# EAGLE design charge controller (EAGLE 9.4.0)
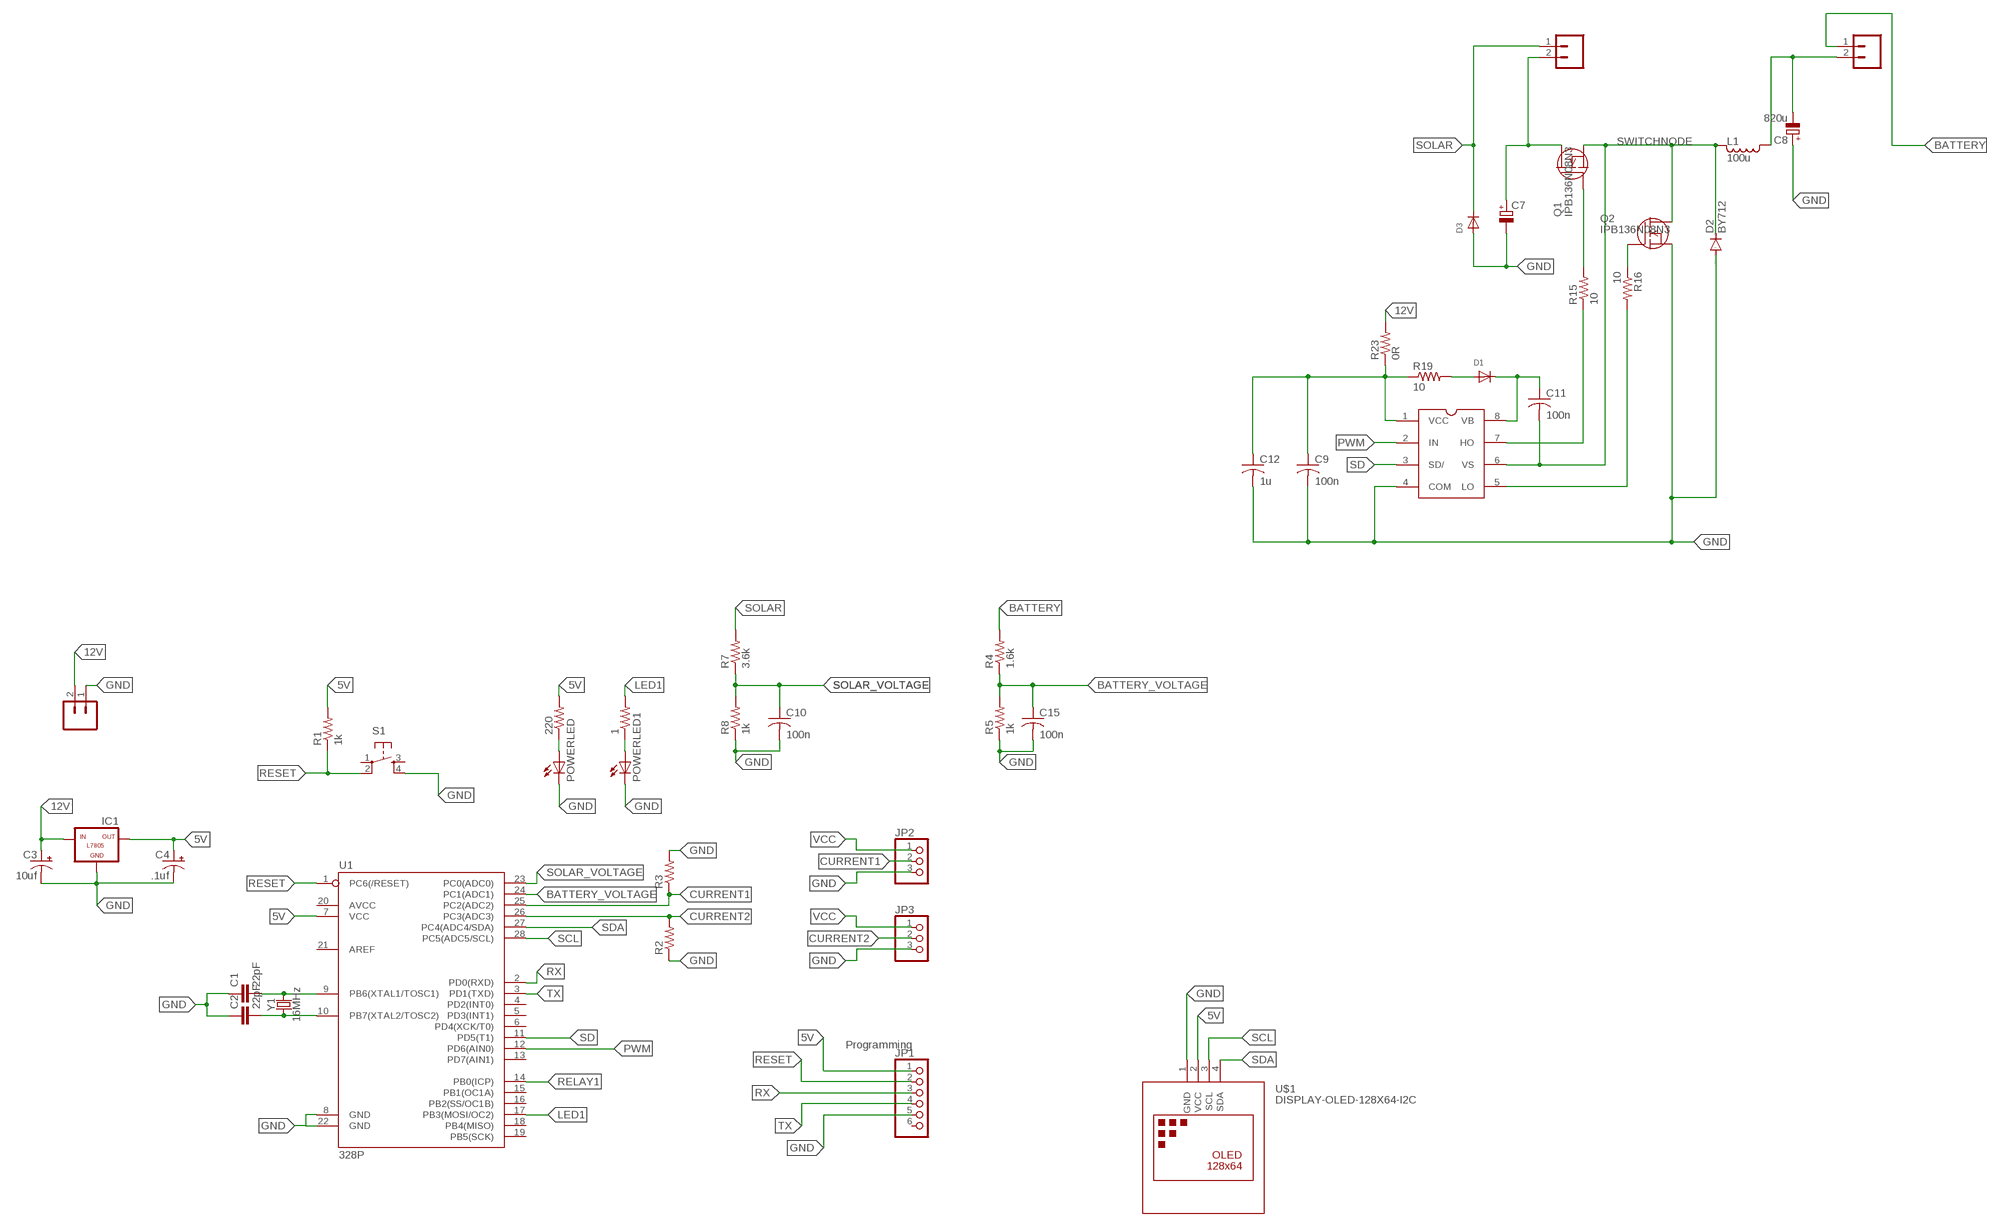
[diagram p0: schematic, sheet 1]

## Parts
1  R-US_0204/5  [0204/5]
220  R-US_0204/5  [0204/5]
BATTERY-OUT  CONN_023.5MM_LOCK  [SCREWTERMINAL-3.5MM-2_LOCK]
C1  22pF  22PF-PTH-2.54MM-200V-5%  [CAP-PTH-2.54]
C2  22pF  22PF-PTH-2.54MM-200V-5%  [CAP-PTH-2.54]
C3  10uf  CPOL-USE5-5  [E5-5]
C4  .1uf  CPOL-USE5-5  [E5-5]
C7  680u  C_POLARIZED10MM  [10MM]
C8  820u  C_POLARIZED10MM  [10MM]
C9  100n  C-US050-025X075  [C050-025X075]
C10  100n  C-US050-025X075  [C050-025X075]
C11  100n  C-US050-055X075  [C050-055X075]
C12  1u  C-US050-025X075  [C050-025X075]
C15  100n  C-US050-025X075  [C050-025X075]
D1  DIODEDO-1N4148  [DO-1N4148]
D2  BY712  [SOD61E]
D3  DIODEDO-1N4148  [DO-1N4148]
IC1  L7805  [78XXL]
J1  CONN_023.5MM_LOCK  [SCREWTERMINAL-3.5MM-2_LOCK]
JP1  PINHD-1X6  [1X06]
JP2  PINHD-1X3  [1X03]
JP3  PINHD-1X3  [1X03]
L1  100u  INDUCTORMSS1583  [MSS1583]
POWERLED  LED5MM  [LED5MM]
POWERLED1  LED5MM  [LED5MM]
Q1  IPB136N08N3  IRF840  [TO220]
Q2  IPB136N08N3  IRF840  [TO220]
R1  1k  R-US_0204/5  [0204/5]
R2  R-US_0204/5  [0204/5]
R3  R-US_0204/5  [0204/5]
R4  1.6k  R-US_0204/5  [0204/5]
R5  1k  R-US_0204/5  [0204/5]
R7  3.6k  R-US_0204/5  [0204/5]
R8  1k  R-US_0204/5  [0204/5]
R15  10  R-US_0204/7  [0204/7]
R16  10  R-US_0204/7  [0204/7]
R19  10  R-US_0204/7  [0204/7]
R23  0R  R-US_0204/7  [0204/7]
S1  TAC_SWITCHPTH  [TACTILE-PTH]
SOLAR-IN  CONN_023.5MM_LOCK  [SCREWTERMINAL-3.5MM-2_LOCK]
U1  328P  ATMEGA328P_PDIP  [DIP28]
U$1  DISPLAY-OLED-128X64-I2C  [DISPLAY-OLED-128X64-I2C]
U$2  IR2104  [IR2104]
Y1  16MHz  CRYSTAL-16MHZPTH-HC49US  [HC49US]

## Nets
5V: 220.2 C4.+ IC1.OUT JP1.1 R1.2 U1.7(VCC) U$1.2(VCC)
12V: C3.+ IC1.IN J1.2 R23.2
BATTERY: BATTERY-OUT.1 R4.2
BATTERY_VOLTAGE: C15.1 R4.1 R5.2 U1.24(PC1(ADC1))
CURRENT1: JP2.2 R3.1 U1.25(PC2(ADC2))
CURRENT2: JP3.2 R2.2 U1.26(PC3(ADC3))
GND: C1.1 C2.1 C3.- C4.- C7.- C8.+ C9.2 C10.2 C12.2 C15.2 D2.A D3.A IC1.GND J1.1 JP1.5 JP2.3 JP3.3 POWERLED1.K(C) POWERLED.K(C) Q2.3(S) R2.1 R3.2 R5.1 R8.1 S1.4 U1.8(GND) U1.22(GND) U$1.1(GND) U$2.4(COM)
LED1: 1.2 U1.17(PB3(MOSI/OC2))
N$1: 220.1 POWERLED.A
N$2: C1.2 U1.9(PB6(XTAL1/TOSC1)) Y1.2
N$3: C2.2 U1.10(PB7(XTAL2/TOSC2)) Y1.1
N$4: D1.A R19.2
N$5: 1.1 POWERLED1.A
N$7: BATTERY-OUT.2 C8.- L1.1
N$8: Q1.1(G) R15.2
N$9: C7.+ Q1.2(D) SOLAR-IN.2
N$11: Q2.1(G) R16.1
N$12: C11.1 D1.C U$2.8(VB)
N$14: R15.1 U$2.7(HO)
N$15: R16.2 U$2.5(LO)
N$19: C9.1 C12.1 R19.1 R23.1 U$2.1(VCC)
PWM: U1.12(PD6(AIN0)) U$2.2(IN)
RELAY1: U1.14(PB0(ICP))
RESET: JP1.2 R1.1 S1.2 U1.1(PC6(/RESET))
RX: JP1.3 U1.2(PD0(RXD))
SCL: U1.28(PC5(ADC5/SCL)) U$1.3(SCL)
SD: U1.11(PD5(T1)) U$2.3(SD/)
SDA: U1.27(PC4(ADC4/SDA)) U$1.4(SDA)
SOLAR: D3.C R7.2 SOLAR-IN.1
SOLAR_VOLTAGE: C10.1 R7.1 R8.2 U1.23(PC0(ADC0))
SWITCHNODE: C11.2 D2.C L1.2 Q1.3(S) Q2.2(D) U$2.6(VS)
TX: JP1.4 U1.3(PD1(TXD))
VCC: JP2.1 JP3.1
Unconnected: JP1.6 S1.1 S1.3 U1.4(PD2(INT0)) U1.5(PD3(INT1)) U1.6(PD4(XCK/T0)) U1.13(PD7(AIN1)) U1.15(PB1(OC1A)) U1.16(PB2(SS/OC1B)) U1.18(PB4(MISO)) U1.19(PB5(SCK)) U1.20(AVCC) U1.21(AREF)

## Notes on the sheet
- Programming

## Library data of the parts
1 220 R1-R5 R7 R8 R15 R16 R19 R23 = adafruit:R-US_: RESISTOR, American symbol
BATTERY-OUT J1 SOLAR-IN = SparkFun-Connectors:CONN_02: Multi connection point. Often used as Generic Header-pin footprint for 0.1 inch spaced/style header connections On any of the 0.1 inch spaced packages, you can populate with these: Break Away Headers - Straight <https://www.sparkfun.com/products/116> (PRT-00116) Break Away Male Headers - Right Angle <https://www.sparkfun.com/products/553> (PRT-00553) Female Headers <https://www.sparkfun.com/products/115> (PRT-00115) Break Away Headers - Machine Pin <https://www.sparkfun.com/products/117> (PRT-00117) Break Away Female Headers - Swiss Machine Pin <https://www.sparkfun.com/products/743> (PRT-00743) For SCREWTERMINALS and SPRING TERMINALS visit here: Screw Terimnals on SparkFun.com <https://www.sparkfun.com/search/results?term=Screw+Terminals> (5mm/3.5mm/2.54mm spacing) This device is also useful as a general connection point to wire up your design to another part of your project. Our various solder wires solder well into these plated through hole pads. Hook-Up Wire - Assortment (Stranded, 22 AWG) <https://www.sparkfun.com/products/11375> (PRT-11375) Hook-Up Wire - Assortment (Solid Core, 22 AWG) <https://www.sparkfun.com/products/11367> (PRT-11367) View the entire wire category on our website here <https://www.sparkfun.com/categories/141> Special notes: Molex polarized connector foot print use with: PRT-08233 with associated crimp pins and housings. 2.54_SCREWTERM for use with PRT-10571. 3.5mm Screw Terminal footprints for PRT-08084 5mm Screw Terminal footprints for use with PRT-08432; PROD_ID: CONN-08399
C1 C2 = SparkFun-Capacitors:22PF: 22pF ceramic capacitors A capacitor is a passive two-terminal electrical component used to store electrical energy temporarily in an electric field.; PROD_ID: CAP-09128
C3 C4 = adafruit:CPOL-US: POLARIZED CAPACITOR, American symbol
C7 C8 = 00Capacitor:C_POLARIZED
C9-C12 C15 = adafruit:C-US: CAPACITOR, American symbol
D1 D3 = adafruit:DIODE: Diode SMADIODE - SMA Surface Mount Package 20V 1A Schottky Diode Digikey: 641-1014-6-ND DO-1N4148 - Through Hole Small Current Diode SOD-123 20V 1 A (.5mV Vf) Schottky Diode - Digikey: MBRX120TPMSCT-ND SOD-323 10V 570mA (.38mV Vf, 3ns) Schottky Diode - Digikey: ZLLS410CT-ND SOD-523 30V 30mA Schottky Diode (RB751S-40TE61) - Digikey: RB751S-40TE61CT-ND SOT23-R/W - SOT23 Package (R = Solder Paste/Reflow Ovens, W = Hand-Soldering) BAT54Film 40V 300mA - Digikey: 497-7162-1-ND
D2 = diode:BY712: DIODE fast high-voltage soft-recovery rectifier
IC1 = tango:L7805: VOLTAGE REGULATOR
JP1 = adafruit:PINHD-1X6: PIN HEADER
JP2 JP3 = adafruit:PINHD-1X3: PIN HEADER
L1 = 00Inductor:INDUCTOR
POWERLED POWERLED1 = adafruit:LED: LED OSRAM: - CHIPLED LG R971, LG N971, LY N971, LG Q971, LY Q971, LO R971, LY R971 LH N974, LH R974 LS Q976, LO Q976, LY Q976 LO Q996 - Hyper CHIPLED LW Q18S LB Q993, LB Q99A, LB R99A - SideLED LS A670, LO A670, LY A670, LG A670, LP A670 LB A673, LV A673, LT A673, LW A673 LH A674 LY A675 LS A676, LA A676, LO A676, LY A676, LW A676 LS A679, LY A679, LG A679 - Hyper Micro SIDELED® LS Y876, LA Y876, LO Y876, LY Y876 LT Y87S - SmartLED LW L88C, LW L88S LB L89C, LB L89S, LG L890 LS L89K, LO L89K, LY L89K LS L896, LA L896, LO L896, LY L896 - TOPLED LS T670, LO T670, LY T670, LG T670, LP T670 LSG T670, LSP T670, LSY T670, LOP T670, LYG T670 LG T671, LOG T671, LSG T671 LB T673, LV T673, LT T673, LW T673 LH T674 LS T676, LA T676, LO T676, LY T676, LB T676, LH T676, LSB T676, LW T676 LB T67C, LV T67C, LT T67C, LS T67K, LO T67K, LY T67K, LW E67C LS E67B, LA E67B, LO E67B, LY E67B, LB E67C, LV E67C, LT E67C LW T67C LS T679, LY T679, LG T679 LS T770, LO T770, LY T770, LG T770, LP T770 LB T773, LV T773, LT T773, LW T773 LH T774 LS E675, LA E675, LY E675, LS T675 LS T776, LA T776, LO T776, LY T776, LB T776 LHGB T686 LT T68C, LB T68C - Hyper Mini TOPLED® LB M676 - Mini TOPLED Santana® LG M470 LS M47K, LO M47K, LY M47K Source: http://www.osram.convergy.de/
Q1 Q2 = tango:IRF840: N-Channel Enhancement MOSFET (HEXFET); 500V; 8A; 0,85Ohm
S1 = SparkFun-Retired:TAC_SWITCH: Momentary Switch Button commonly used for reset or general input. Spark Fun Electronics SKU : COM-00097 SMT- SWCH-08247
U1 = SparkFun-IC-Microcontroller:ATMEGA328P_PDIP: Atmel 328P Through hole ATMEGA328P uC used in the Arduino 32kb flash, 1k EEPROM, 2k SRAM Datasheet <http://www.sparkfun.com/datasheets/Components/SMD/ATMega328.pdf> SparkFun Products Storefront component: AVR 28 Pin 20MHz 32K 6A/D - ATMega328P <https://www.sparkfun.com/products/9061> (COM-09061) SparkFun Simon Says - Through-Hole Soldering Kit <https://www.sparkfun.com/products/10547> (KIT-10547) SparkFun Learn to Solder - Simon Says <https://www.sparkfun.com/products/13708> (KIT-13708) SparkFun BigTime Watch Kit <https://www.sparkfun.com/products/11734> (KIT-11734) SparkFun ClockIt <https://www.sparkfun.com/products/10930> (KIT-10930) SparkFun Serial Enabled LCD Kit <https://www.sparkfun.com/products/10097> (LCD-10097) SparkFun Simon Tilts - Through Hole Soldering Kit <https://www.sparkfun.com/products/12634> (KIT-12634) SparkFun Frequency Counter Kit <https://www.sparkfun.com/products/10140> (KIT-10140) FabFM Radio Kit <https://www.sparkfun.com/products/11043> (KIT-11043) SparkFun Binary Blaster Kit <https://www.sparkfun.com/products/12037> (KIT-12037) SparkFun Metro-Gnome <https://www.sparkfun.com/products/9236> (KIT-09236) ATmega328 with Arduino Optiboot (Uno) <https://www.sparkfun.com/products/10524> (DEV-10524); PROD_ID: IC-09136
U$1 = diy-modules:DISPLAY-OLED-128X64-I2C: 128x64 Dot Matrix OLED Module based on SSD1306 chip Variant with I2C interface More details available here: http://www.instructables.com/id/Monochrome-096-i2c-OLED-display-with-arduino-SSD13/ SSD1306 datasheet: https://cdn-shop.adafruit.com/datasheets/SSD1306.pdf Click here to find device on ebay.com <http://www.ebay.com/sch/oled+display+128x64+iic> Note: There are two variants: I2C and SPI. Search for the proper version.
U$2 = ir-2104:IR2104: Half Bridge mosfet - IGBT driver
Y1 = SparkFun-Clocks:CRYSTAL-16MHZ: 16MHz Crystal Digikey Example <http://www.digikey.com/product-search/en?keywords=535-9122-1-ND> Frequency: 16MHz Frequency Stability: ±50ppm Frequency Tolerance: ±20ppm Load Capacitance: 18pF SparkFun Products: Pro Micro -5V/16MHz <https://www.sparkfun.com/products/12640> SparkFun Serial Enabled LCD Kit <https://www.sparkfun.com/products/10097>; PROD_ID: XTAL-08181; SF_ID: COM-00536

## Board
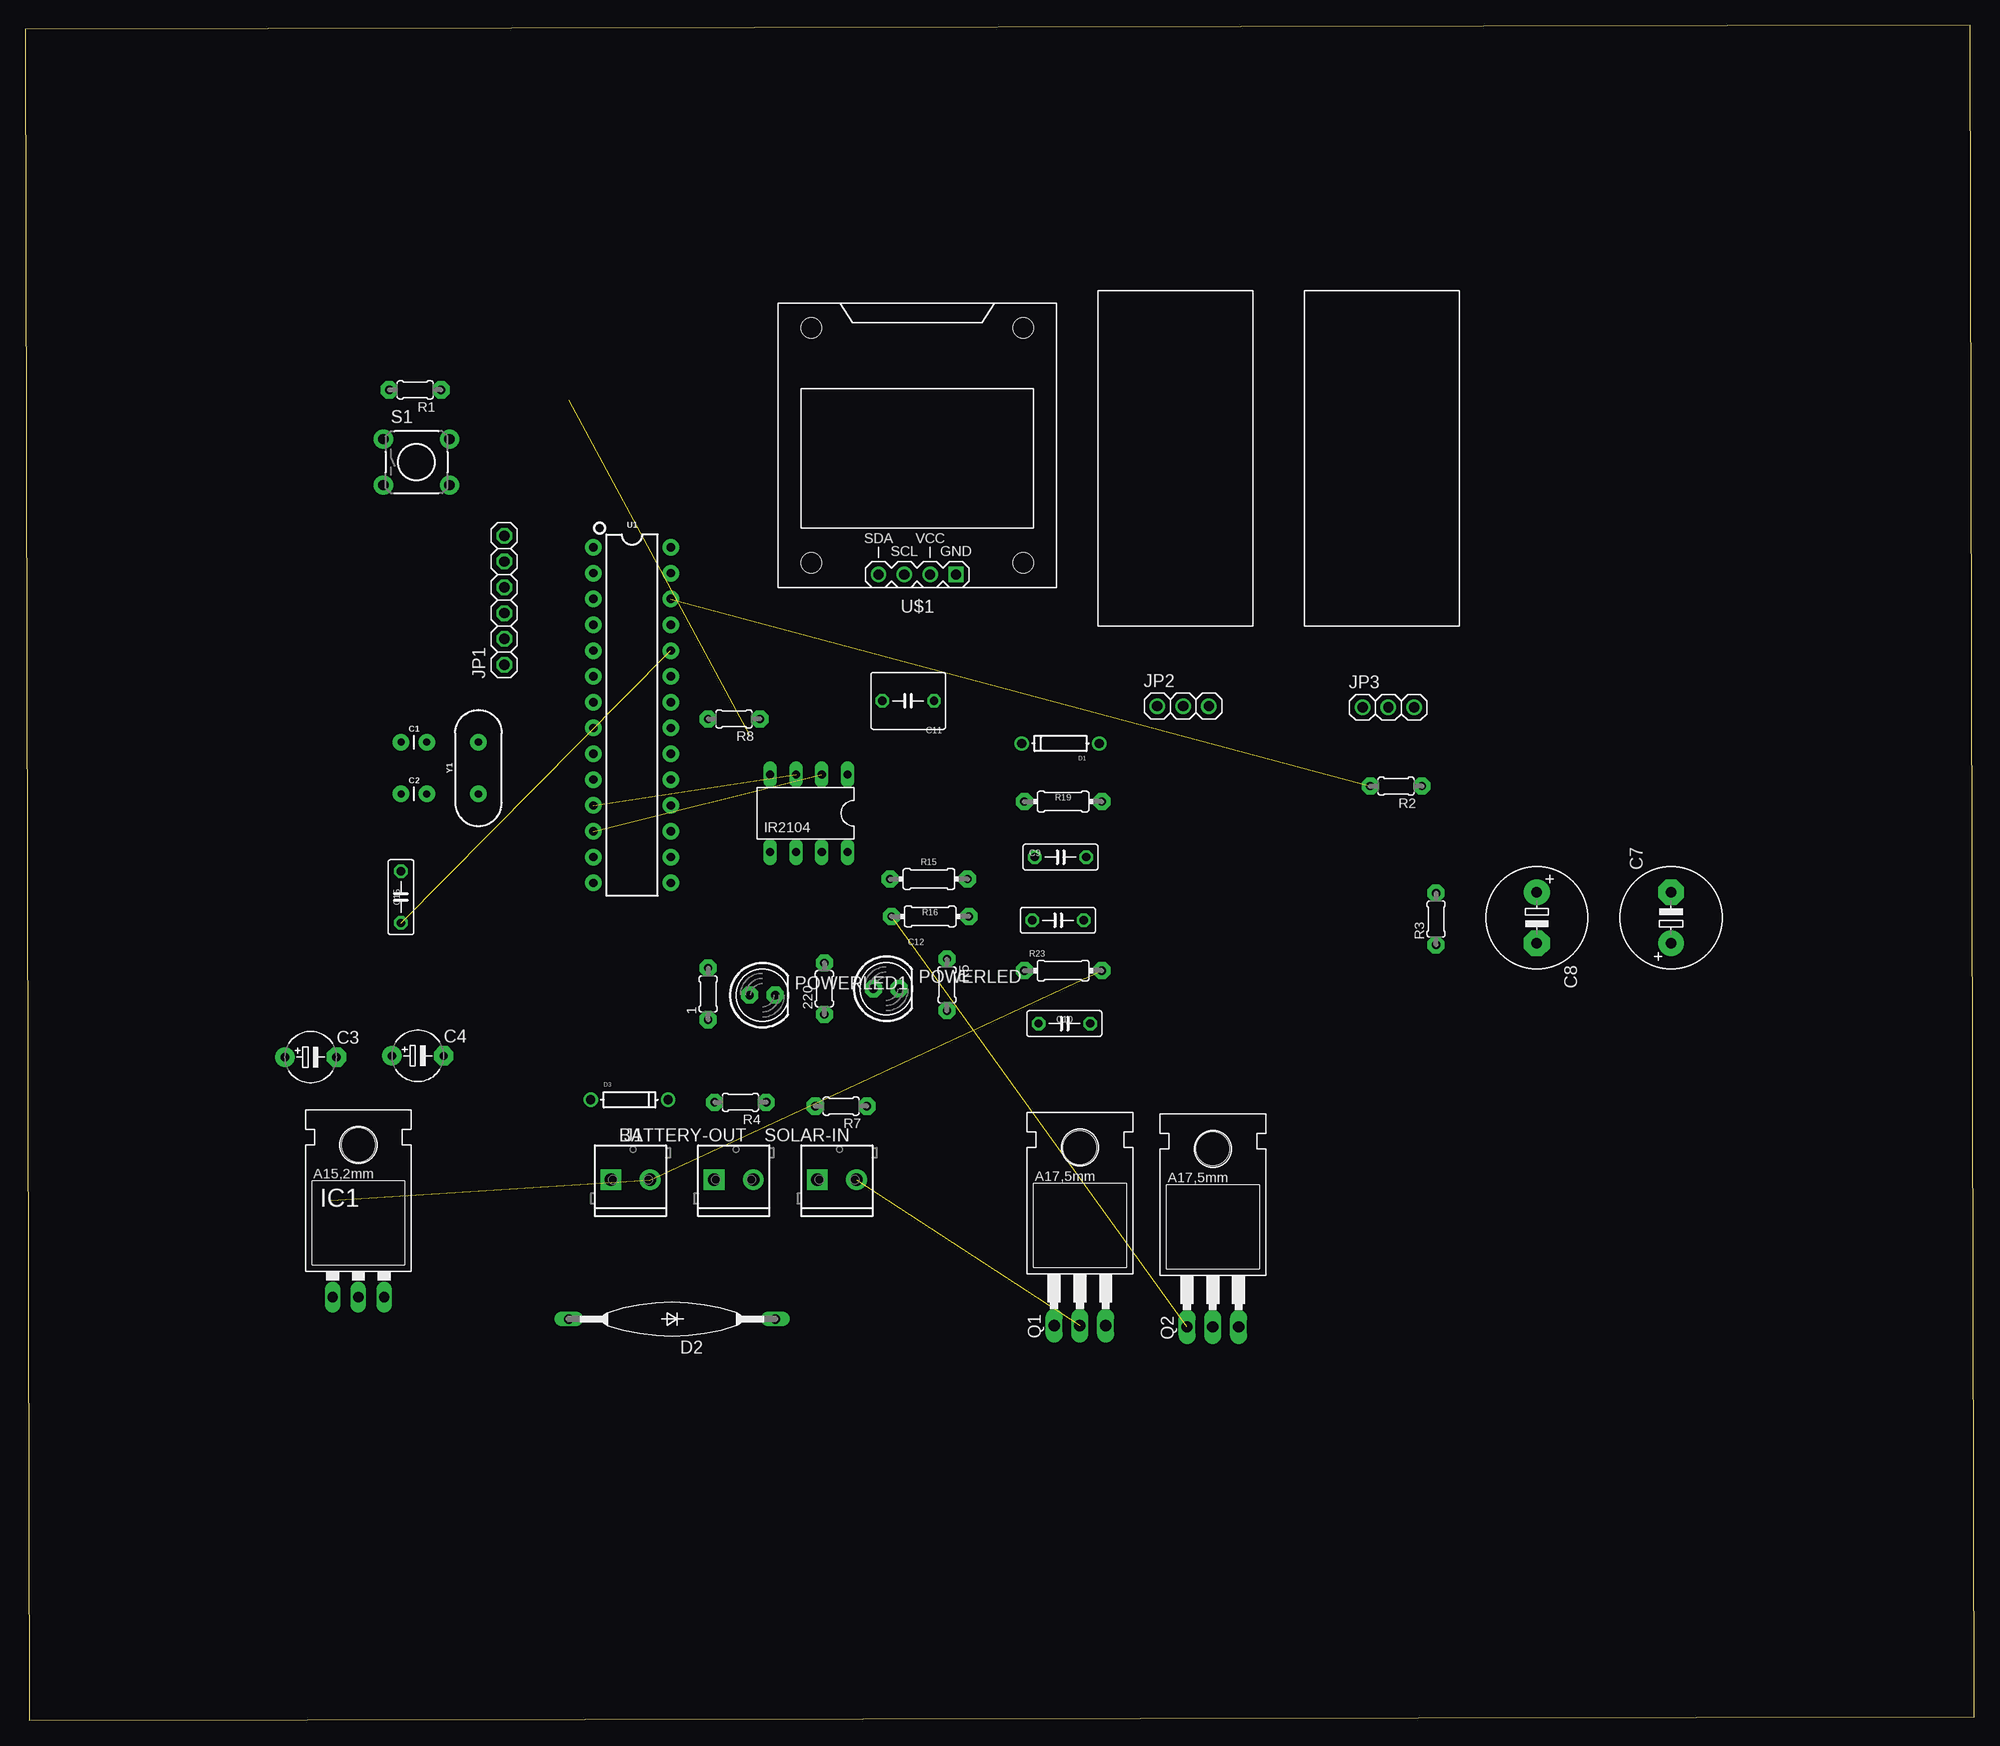
[diagram p1: board, top side]
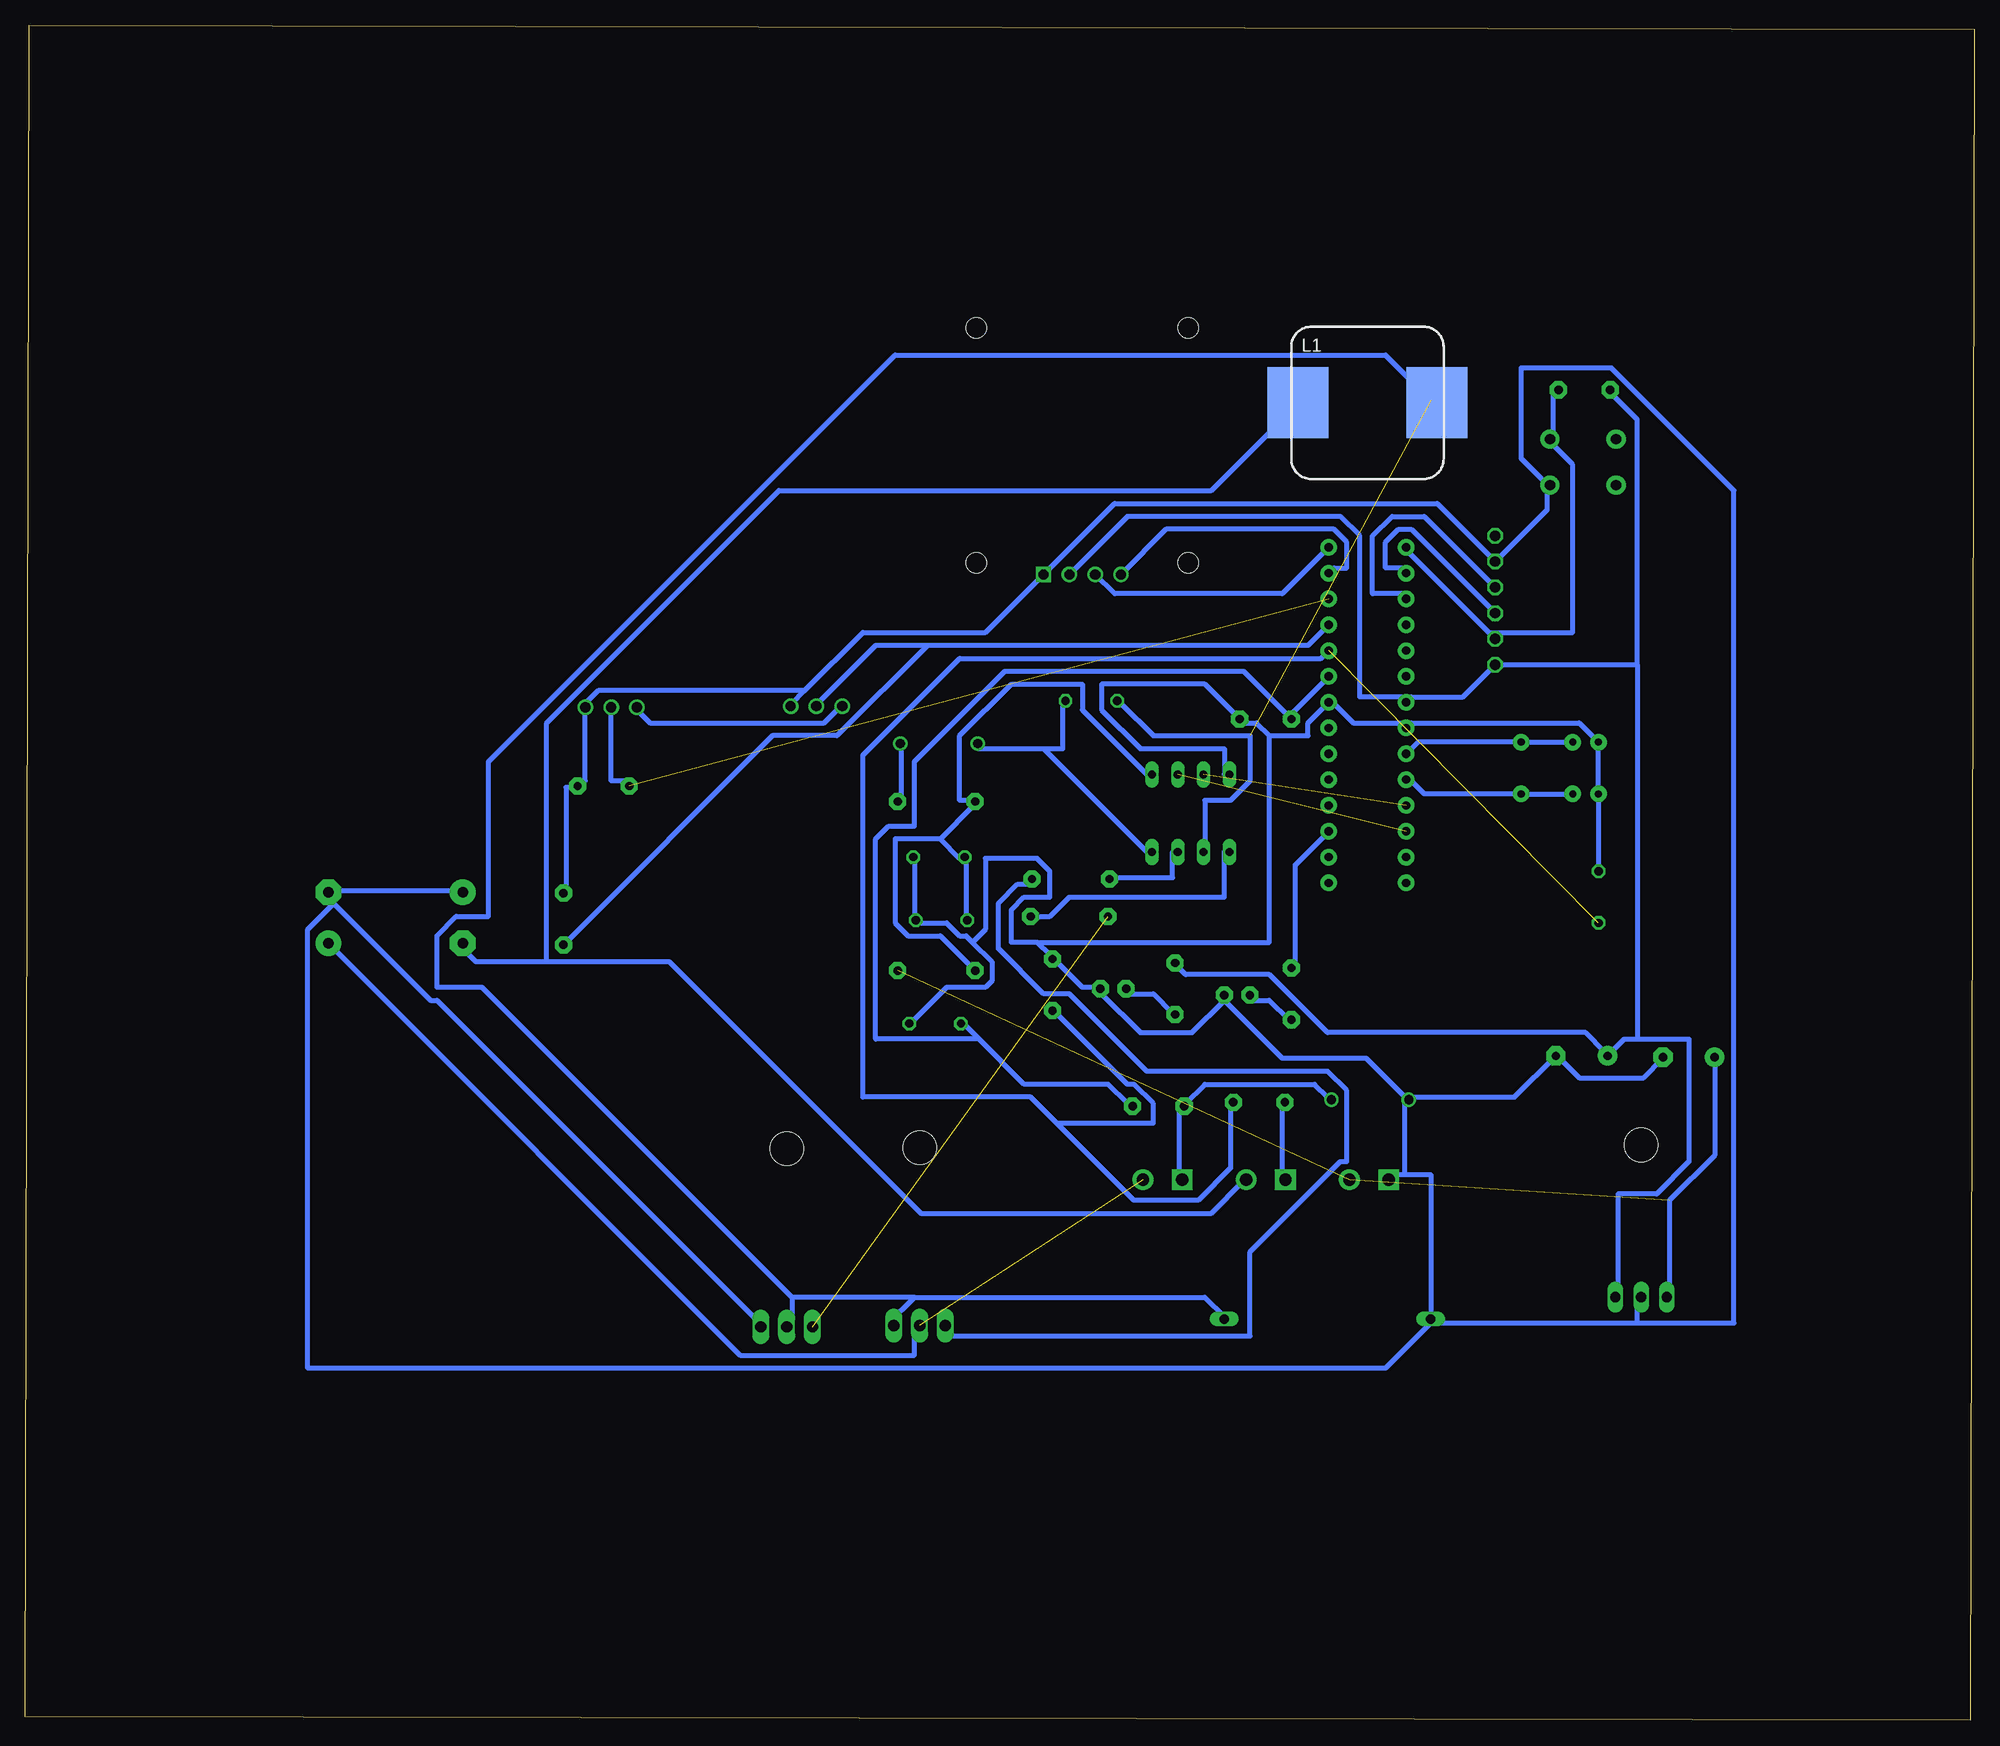
[diagram p2: board, bottom side, seen from below]

Size 191.75 x 166.8 mm. Coordinates in mm from the lower left corner, seen from the top.
Outline: 0.38,0 191.75,0.38 191.37,166.8 0,166.42 0.38,0
Copper layers (1*16): Top 0.035mm / dielectric 1.5mm / Bottom 0.035mm
Design rules "default *": minimum track width 20mil, minimum drill 0.35mm, track to track 20mil, track to pad 20mil, pad to pad 6mil, via to via 6mil, smd to smd 6mil, copper to edge 40mil, drill to drill 6mil, minimum pad ring 10mil, minimum via ring 8mil, stop-mask expansion 4mil, vias tented up to drill 0mil, thermal gap 10mil

### Footprints (pad centres in the part's own frame; a part is rotated, then mirrored left to right if it is on the bottom)
0204/5 = drill 0.813 pad 1.676 octagon: 1 -2.54,0; 2 2.54,0
SCREWTERMINAL-3.5MM-2_LOCK = drill 1.2 pad 2.032 square: 1 -0.178,0 | drill 1.2 pad 2.032: 2 3.678,0
CAP-PTH-2.54 = drill 0.7 pad 1.651: 1 -1.27,0; 2 1.27,0
E5-5 = drill 0.813 pad 1.905: + -2.54,0 | drill 0.813 pad 1.905 octagon: - 2.54,0
10MM = drill 1.016 pad 2.54: + -2.5,0 | drill 1.016 pad 2.54 octagon: - 2.5,0
C050-025X075 = drill 0.813 octagon: 1 -2.54,0; 2 2.54,0
C050-055X075 = drill 0.813 octagon: 1 -2.54,0; 2 2.54,0
DO-1N4148 = drill 0.9: A -3.81,0; C 3.81,0
SOD61E = drill 0.914 long: A 10.16,0; C -10.16,0
78XXL = drill 1.016 long: GND 0,-3.81; IN -2.54,-3.81; OUT 2.54,-3.81 | hole 3.302: 0,11.176
1X06 = drill 1.016 octagon: 1 -6.35,0; 2 -3.81,0; 3 -1.27,0; 4 1.27,0; 5 3.81,0; 6 6.35,0
1X03 = drill 1.016: 1 -2.54,0; 2 0,0; 3 2.54,0
MSS1583 = smd 6 x 7: 1 -6.85,0; 2 6.85,0
LED5MM = drill 0.813 pad 1.676 octagon: A -1.27,0; K 1.27,0
TO220 = drill 1.118 long: 1 -2.54,-6.35; 2 0,-6.35; 3 2.54,-6.35 | hole 3.302: 0,11.176
0204/7 = drill 0.813 pad 1.676 octagon: 1 -3.81,0; 2 3.81,0
TACTILE-PTH = drill 1.016 pad 1.88: 1 -3.251,2.261; 2 3.251,2.261; 3 -3.251,-2.261; 4 3.251,-2.261
DIP28 = drill 0.813 pad 1.626: 1 -16.51,-3.81; 2 -13.97,-3.81; 3 -11.43,-3.81; 4 -8.89,-3.81; 5 -6.35,-3.81; 6 -3.81,-3.81; 7 -1.27,-3.81; 8 1.27,-3.81; 9 3.81,-3.81; 10 6.35,-3.81; 11 8.89,-3.81; 12 11.43,-3.81; 13 13.97,-3.81; 14 16.51,-3.81; 15 16.51,3.81; 16 13.97,3.81; 17 11.43,3.81; 18 8.89,3.81; 19 6.35,3.81; 20 3.81,3.81; 21 1.27,3.81; 22 -1.27,3.81; 23 -3.81,3.81; 24 -6.35,3.81; 25 -8.89,3.81; 26 -11.43,3.81; 27 -13.97,3.81; 28 -16.51,3.81
DISPLAY-OLED-128X64-I2C = drill 1 square: 1 -3.81,12.7 | drill 1: 2 -1.27,12.7; 3 1.27,12.7; 4 3.81,12.7 | hole 2: -10.414,11.557; 10.414,11.557; 10.414,-11.557; -10.414,-11.557
IR2104 = drill 0.8 long: 1 -1.905,8.89; 2 -1.905,6.35; 3 -1.905,3.81; 4 -1.905,1.27; 5 5.715,1.27; 6 5.715,3.81; 7 5.715,6.35; 8 5.715,8.89
HC49US = drill 0.7 pad 1.651: 1 -2.54,0; 2 2.54,0

### Placement (x,y rotation side)
1  67.18,71.5 90 top
220  78.61,72.01 90 top
BATTERY-OUT  67.94,53.21 0 top
C1  38.23,96.27 0 top
C2  38.23,91.19 0 top
C3  28.07,65.28 0 top
C4  38.61,65.41 0 top
C7  161.93,78.99 90 top
C8  148.72,78.99 270 top
C9  101.85,84.96 0 top
C10  102.23,68.58 0 top
C11  86.87,100.33 180 top
C12  101.6,78.74 0 top
C15  36.96,81.03 90 top
D1  101.85,96.14 180 top
D2  63.63,39.5 180 top
D3  59.44,61.09 0 top
IC1  32.77,45.47 0 top
J1  57.78,53.21 0 top
JP1  47.12,110.24 90 top
JP2  113.92,99.82 0 top
JP3  134.11,99.69 0 top
L1  59.69,129.67 0 bottom
POWERLED  84.71,72.01 0 top
POWERLED1  72.52,71.37 0 top
Q1  103.76,45.21 0 top
Q2  116.84,45.09 0 top
R1  38.35,130.94 180 top
R2  134.87,91.95 180 top
R3  138.81,78.87 90 top
R4  70.36,60.83 180 top
R5  90.68,72.39 270 top
R7  80.26,60.45 180 top
R8  69.72,98.55 180 top
R15  88.9,82.8 0 top
R16  89.03,79.12 0 top
R19  102.11,90.42 0 top
R23  102.11,73.79 0 top
S1  38.48,123.83 0 top
SOLAR-IN  78.11,53.21 0 top
U1  59.69,98.93 270 top
U$1  87.76,125.48 180 top
U$2  72.01,91.19 270 top
Y1  44.58,93.73 90 top

### Tracks (layer width: path | path; a pad name or v marks a point on that pad's centre or on a via)
5V
  Bottom 0.508: 33.15,67.06 34.42,67.06 C4.+ 36.32,65.79 38.23,67.69 63.63,67.69 69.34,73.41 77.6,73.41 78.23,74.04 220.2 | 33.15,67.06 28.07,67.06 28.07,54.99 31.24,51.82 35.05,51.82 35.05,41.66 IC1.OUT | U$1.2 83.31,118.49 62.36,118.49 60.45,116.59 60.45,100.71 56.01,100.71 U1.7 55.37,100.71 50.29,100.71 JP1.1 33.15,103.89 | 33.15,103.89 33.15,128.02 35.69,130.56 R1.2 | 33.15,103.89 33.15,67.06
12V  (2 unrouted)
  Bottom 0.508: C3.+ 25.53,55.63 29.97,51.18 29.97,41.66 IC1.IN
BATTERY
  Bottom 0.508: R4.2 68.07,60.71 68.07,53.72 BATTERY-OUT.1
BATTERY_VOLTAGE  (1 unrouted)
  Bottom 0.508: U1.24 64.26,104.52 99.82,104.52 109.35,95 109.35,61.34 92.84,61.34 90.3,58.8 | 90.3,58.8 82.68,51.18 76.33,51.18 73.15,54.36 73.15,60.71 R4.1 | 90.3,58.8 80.77,58.8 80.77,60.71 82.68,62.61 83.31,62.61 90.3,69.6 R5.2
CURRENT1
  Bottom 0.508: 103,105.79 65.53,105.79 U1.25 | 103,105.79 108.08,105.79 113.79,100.08 JP2.2 | R3.1 118.24,96.9 111.89,96.9 103,105.79
CURRENT2  (1 unrouted)
  Bottom 0.508: JP3.2 134.11,92.46 132.84,92.46 R2.2
GND
  Bottom 0.508: R3.2 138.56,81.66 138.56,91.82 137.92,91.82 R2.1 137.29,92.46 136.65,92.46 JP3.3 136.65,100.08 135.38,101.35 115.06,101.35 | 115.06,101.35 116.33,100.08 JP2.3 | 115.06,101.35 109.35,107.06 97.28,107.06 U$1.1 84.58,119.76 52.83,119.76 JP1.5 42.04,119.13 42.04,121.03 S1.4 42.04,121.67 44.58,124.21 44.58,133.1 35.69,133.1 23.62,121.03 23.62,39.12 33.15,39.12 | 161.42,80.39 162.05,81.03 C7.- | 161.42,80.39 151.89,70.87 151.26,70.87 119.51,39.12 Q2.3 | C8.+ 148.72,81.66 161.42,81.66 C7.- | C15.2 C2.1 C1.1 38.86,98.17 55.37,98.17 U1.8 56.01,98.17 61.09,98.17 62.99,100.08 U1.22 65.53,98.17 65.53,96.9 69.34,96.9 | U$2.4 73.79,93.09 73.79,95.63 82.04,95.63 85.85,99.44 85.85,101.98 75.69,101.98 R8.1 71.88,98.17 70.61,98.17 69.34,96.9 | C9.2 104.27,84.84 104.27,79.12 C12.2 103.63,78.49 101.09,78.49 99.82,77.22 99.19,77.22 98.55,76.58 | 98.55,76.58 96.65,74.68 96.65,72.77 97.28,72.14 101.09,72.14 104.27,68.96 C10.2 | 73.79,70.87 76.96,67.69 82.04,67.69 85.85,71.5 POWERLED.K 86.49,72.14 87.76,72.14 90.3,74.68 R5.1 90.93,75.31 92.2,76.58 | 98.55,76.58 97.28,77.85 97.28,84.84 92.2,84.84 90.93,83.57 90.93,81.03 93.47,81.03 94.74,79.76 94.74,76.58 92.2,76.58 | C3.- 30.61,65.15 32.51,63.25 38.86,63.25 40.77,65.15 C4.- 45.21,61.34 55.37,61.34 D3.A | 56.01,53.72 56.01,60.71 D3.A | 56.01,53.72 57.28,53.72 J1.1 | 56.01,53.72 53.47,53.72 D2.A 53.47,39.12 | 33.15,39.12 33.15,41.66 IC1.GND | 53.47,39.12 33.15,39.12 | 73.79,70.87 68.07,65.15 59.82,65.15 56.01,61.34 D3.A | 73.79,70.87 POWERLED1.K | 69.34,96.9 69.34,76.58 92.2,76.58 | 161.42,80.39 163.96,77.85 163.96,34.67 57.91,34.67 53.47,39.12
  Bottom 0.508: 161.42,80.39 C7.-
LED1
  Bottom 0.508: U1.17 66.8,84.2 66.8,74.04 1.2
N$1
  Bottom 0.508: 220.1 78.87,69.6 80.77,71.5 83.31,71.5 POWERLED.A
N$2
  Bottom 0.508: U1.9 54.74,96.27 Y1.2 C1.2
N$3
  Bottom 0.508: U1.10 55.37,92.46 54.1,91.19 Y1.1 C2.2
N$4
  Bottom 0.508: D1.A 105.54,95.63 105.54,90.55 R19.2
N$5
  Bottom 0.508: 1.1 67.44,68.96 69.34,70.87 71.25,70.87 POWERLED1.A
N$7
  Bottom 0.508: 140.46,74.68 147.45,74.68 148.72,75.95 C8.- | 140.46,74.68 128.4,74.68 103.63,49.91 75.06,49.91 71.88,53.09 BATTERY-OUT.2 | 140.46,74.68 140.46,98.17 117.6,121.03 75.06,121.03 66.8,129.29 L1.1
N$8
  Bottom 0.508: R15.2 92.84,82.3 94.11,82.3 96.01,80.39 96.01,75.95 91.57,71.5 89.03,71.5 81.41,63.88 63.63,63.88 61.72,61.98 61.72,54.99 62.36,54.99 71.25,46.1 71.25,37.85 100.46,37.85 101.09,38.48 Q1.1
N$9  (1 unrouted)
  Bottom 0.508: Q1.2 104.27,38.48 104.27,35.94 121.41,35.94 161.42,75.95 C7.+
N$11  (1 unrouted)
N$12
  Bottom 0.508: 91.57,95.63 81.41,85.47 U$2.8 | 91.57,95.63 97.92,95.63 D1.C | 91.57,95.63 89.66,95.63 89.66,100.08 C11.1
N$14
  Bottom 0.508: U$2.7 78.87,85.47 78.87,82.93 84.58,82.93 R15.1
N$15
  Bottom 0.508: R16.2 90.93,79.12 89.03,81.03 73.79,81.03 73.79,85.47 U$2.5
N$19
  Bottom 0.508: C12.1 99.19,79.12 99.19,84.84 C9.1 99.82,84.84 101.73,86.74 | R23.1 101.73,77.22 104.9,77.22 106.17,78.49 106.17,86.74 101.73,86.74 | U$2.1 81.41,93.09 87.76,99.44 87.76,101.98 94.74,101.98 99.82,96.9 99.82,90.55 98.55,90.55 R19.1 98.55,89.92 101.73,86.74
PWM  (1 unrouted)
RESET
  Bottom 0.508: R1.1 41.4,130.56 41.4,126.11 S1.2 41.4,125.48 39.5,123.57 39.5,107.06 47.75,107.06 | 47.75,107.06 56.01,115.32 U1.1 | 47.75,107.06 JP1.2
RX
  Bottom 0.508: JP1.3 55.37,117.22 56.64,117.22 57.91,115.95 57.91,113.41 56.01,113.41 U1.2
SCL
  Bottom 0.508: U$1.3 84.58,110.87 68.07,110.87 U1.28
SD  (1 unrouted)
SDA
  Bottom 0.508: U$1.4 79.5,117.22 62.99,117.22 61.72,115.95 61.72,113.41 62.99,113.41 U1.27
SOLAR
  Bottom 0.508: D3.C 63.63,61.34 64.9,62.61 75.69,62.61 77.6,60.71 R7.2 78.23,60.07 78.23,53.72 SOLAR-IN.1
SOLAR_VOLTAGE
  Bottom 0.508: 67.44,98.81 U1.23 | 97.92,67.06 93.47,62.61 85.22,62.61 83.31,60.71 R7.1 | 97.92,67.06 99.19,68.33 C10.1 | 67.44,98.81 71.88,103.25 95.38,103.25 104.27,94.36 104.27,88.01 106.81,88.01 108.08,86.74 108.08,67.06 97.92,67.06 | 67.44,98.81 R8.2
SWITCHNODE  (1 unrouted)
  Bottom 0.508: 104.27,41.66 75.69,41.66 73.79,39.75 D2.C | 104.27,41.66 106.81,39.12 Q1.3 | 116.33,41.66 116.33,39.12 Q2.2 | 104.27,41.66 116.33,41.66 | 116.33,41.66 146.81,72.14 151.26,72.14 151.26,77.22 149.35,79.12 146.18,79.12 146.18,94.36 106.17,134.37 57.91,134.37 53.47,129.92 L1.2 | U$2.6 75.69,85.47 75.69,90.55 73.15,90.55 71.25,92.46 71.25,96.9 80.77,96.9 83.95,100.08 C11.2
TX
  Bottom 0.508: JP1.4 54.1,118.49 57.28,118.49 59.18,116.59 59.18,110.87 56.01,110.87 U1.3
VCC
  Bottom 0.508: JP2.1 111.89,99.44 113.16,98.17 130.3,98.17 131.57,99.44 JP3.1